# EAGLE schematic 4chan_mixer (EAGLE 7.1.0)
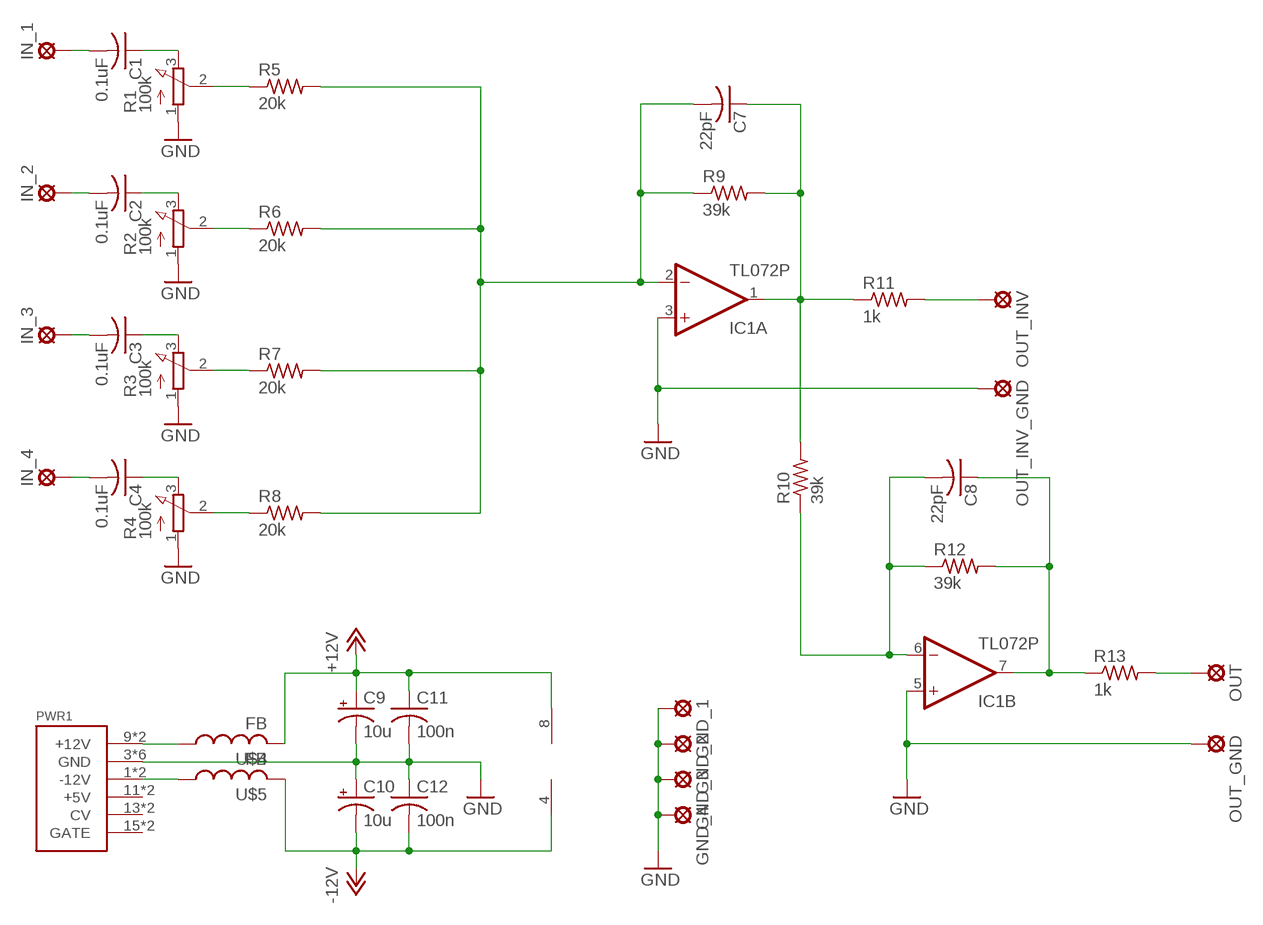
[diagram p0: schematic, sheet 1]

## Parts
C1  0.1uF  C-US050-030X075  [C050-030X075]
C2  0.1uF  C-US050-030X075  [C050-030X075]
C3  0.1uF  C-US050-030X075  [C050-030X075]
C4  0.1uF  C-US050-030X075  [C050-030X075]
C7  22pF  C-US050-030X075  [C050-030X075]
C8  22pF  C-US050-030X075  [C050-030X075]
C9  10u  CPOL-USB45181A  [B45181A]
C10  10u  CPOL-USB45181A  [B45181A]
C11  100n  C-US050-024X044  [C050-024X044]
C12  100n  C-US050-024X044  [C050-024X044]
GND_1  LSP11  [LSP11]
GND_2  LSP11  [LSP11]
GND_3  LSP11  [LSP11]
GND_4  LSP11  [LSP11]
IC1  TL072P  [DIL08]
IN_1  LSP11  [LSP11]
IN_2  LSP11  [LSP11]
IN_3  LSP11  [LSP11]
IN_4  LSP11  [LSP11]
OUT  LSP11  [LSP11]
OUT_GND  LSP11  [LSP11]
OUT_INV  LSP11  [LSP11]
OUT_INV_GND  LSP11  [LSP11]
PWR1  POWER  [POWER_16]
R1  100k  3RP/1610N  [3RP/1610N]
R2  100k  3RP/1610N  [3RP/1610N]
R3  100k  3RP/1610N  [3RP/1610N]
R4  100k  3RP/1610N  [3RP/1610N]
R5  20k  R-US_0207/7  [0207/7]
R6  20k  R-US_0207/7  [0207/7]
R7  20k  R-US_0207/7  [0207/7]
R8  20k  R-US_0207/7  [0207/7]
R9  39k  R-US_0207/7  [0207/7]
R10  39k  R-US_0207/7  [0207/7]
R11  1k  R-US_0207/7  [0207/7]
R12  39k  R-US_0207/7  [0207/7]
R13  1k  R-US_0207/7  [0207/7]
U$4  FB  [FB]
U$5  FB  [FB]

## Nets
+12V: C9.+ C11.1 IC1.8(P:V+) U$4.P$2
-12V: C10.- C12.2 IC1.4(P:V-) U$5.P$2
GND: C9.- C10.+ C11.2 C12.1 GND_1.MP GND_2.MP GND_3.MP GND_4.MP IC1.3(A:+IN) IC1.5(B:+IN) OUT_GND.MP OUT_INV_GND.MP PWR1.3(GND) PWR1.4(GND) PWR1.5(GND) PWR1.6(GND) PWR1.7(GND) PWR1.8(GND) R1.1(A) R2.1(A) R3.1(A) R4.1(A)
N$1: C2.2 IN_2.MP
N$2: C2.1 R2.3(E)
N$3: R2.2(S) R6.1
N$4: C8.2 IC1.6(B:-IN) R10.1 R12.1
N$5: C8.1 IC1.7(B:OUT) R12.2 R13.1
N$6: PWR1.9(+12V) PWR1.10(+12V) U$4.P$1
N$7: C3.2 IN_3.MP
N$8: C3.1 R3.3(E)
N$9: R3.2(S) R7.1
N$10: C4.2 IN_4.MP
N$11: C4.1 R4.3(E)
N$12: R4.2(S) R8.1
N$13: C1.2 IN_1.MP
N$14: C1.1 R1.3(E)
N$15: R1.2(S) R5.1
N$16: C7.2 IC1.2(A:-IN) R5.2 R6.2 R7.2 R8.2 R9.1
N$17: C7.1 IC1.1(A:OUT) R9.2 R10.2 R11.1
N$18: OUT_INV.MP R11.2
N$19: OUT.MP R13.2
N$20: PWR1.1(-12V) PWR1.2(-12V) U$5.P$1
Unconnected: PWR1.11(+5V) PWR1.12(+5V) PWR1.13(CV) PWR1.14(CV) PWR1.15(GATE) PWR1.16(GATE)

## Library data of the parts
C1-C4 C7 C8 C11 C12 = rcl:C-US: CAPACITOR, American symbol
C9 C10 = rcl:CPOL-US: POLARIZED CAPACITOR, American symbol
GND_1-GND_4 IN_1-IN_4 OUT OUT_GND OUT_INV OUT_INV_GND = solpad:LSP11: SOLDER PAD drill 1.1 mm
IC1 = linear:TL072: OP AMP
PWR1 = eurorack:POWER
R1-R4 = pot:3RP/1610N: 16mm Potentiometer one level Source: http://www.alphapotentiometers.net/html/16mm_pot_2.html
R5-R13 = rcl:R-US_: RESISTOR, American symbol
U$4 U$5 = adafruit:FB: Ferrite bead Digikey #P9821BK-ND